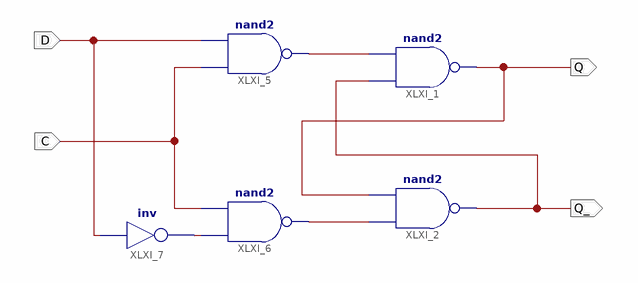
[diagram p0: schematic sheet 1]
// Xilinx ISE schematic D_Latch.sch (kintex7) as structural Verilog: 5 symbols, 4 ports
module D_Latch (
  input  C,
  input  D,
  output Q,
  output Q_
);

  wire XLXN_8, XLXN_10, XLXN_14;

  nand XLXI_2 (Q_, XLXN_10, Q);
  nand XLXI_1 (Q, Q_, XLXN_8);
  nand XLXI_5 (XLXN_8, C, D);
  nand XLXI_6 (XLXN_10, XLXN_14, C);
  not XLXI_7 (XLXN_14, D);
endmodule
